# Altium project BlackChat.PrjPcb
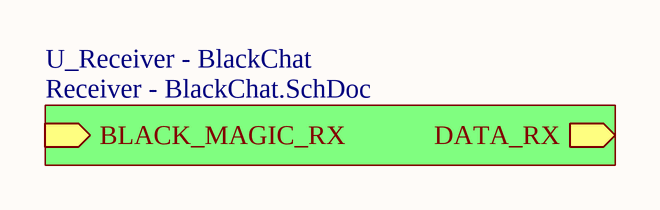
[diagram p0: Top Level - BlackChat.SchDoc]
4 sheets, 96 parts. Net scope: hierarchical (ports join the sheet entries above them; power ports are global).
Sheets:
  Top Level - BlackChat.SchDoc
    U_Receiver - BlackChat = Receiver - BlackChat.SchDoc
  Transmitter - BlackChat.SchDoc
  Digital - BlackChat.SchDoc

## Sheet Top Level - BlackChat.SchDoc
size Letter

### Sub-sheets
U_Receiver - BlackChat = Receiver - BlackChat.SchDoc: DATA_RX (out), BLACK_MAGIC_RX (in)

## Sheet Receiver - BlackChat.SchDoc
size Letter
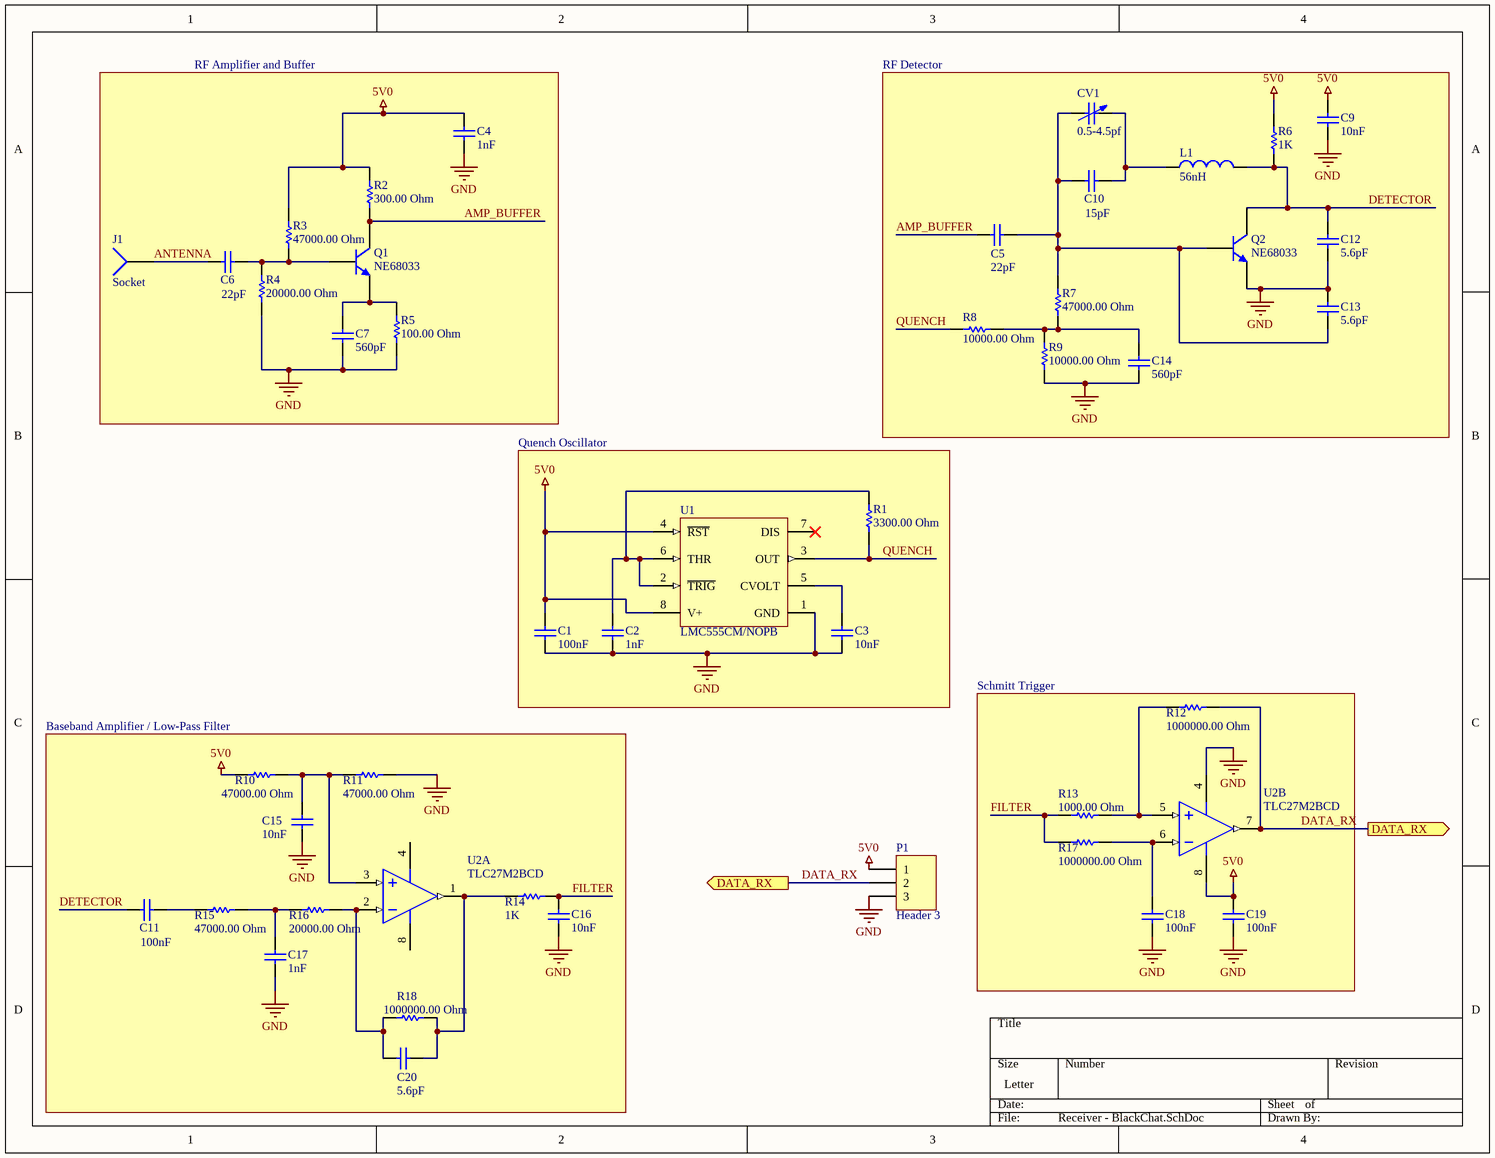
[diagram p1: Receiver - BlackChat.SchDoc]

### Parts
(Parts that share a designator on the sheet are numbered #1, #2 ... from top to bottom, then left to right.)
C1#1  value 100nF  [CAPC0805(2012)100_M]  (hidden comment: CAP 100nF 25V 0805(2012))
C2#1  value 1nF  [CAPC0805(2012)100_N]  (hidden comment: CAP 1nF 25V 0805(2012))
C3#1  value 10nF  [CAPC0805(2012)75_L]  (hidden comment: CAP 10nF 25V 0805(2012))
C4#1  value 1nF  [CAPC0805(2012)145_N]  (hidden comment: CAP 1nF 16V 0805(2012))
C5#1  value 22pF  [CAPC0805(2012)75_L]  (hidden comment: CAP 22pF 16V 0805(2012))
C6#1  value 22pF  [CAPC0805(2012)75_L]  (hidden comment: CAP 22pF 16V 0805(2012))
C7#1  value 560pF  [CAPC0805(2012)145_N]  (hidden comment: CAP 560pF 16V 0805(2012))
C9#1  value 10nF  [CAPC0805(2012)145_N]  (hidden comment: CAP 10nF 16V 0805(2012))
C10#1  value 15pF  [CAPC0805(2012)100_L]  (hidden comment: CAP 1.5pF 16V 0805(2012))
C11#1  value 100nF  [CAPC0805(2012)100_L]  (hidden comment: CAP 100nF 16V 0805(2012))
C12#1  value 5.6pF  [CAPC0805(2012)75_M]  (hidden comment: CAP 5.6pF 16V 0805(2012))
C13  value 5.6pF  [CAPC0805(2012)75_M]  (hidden comment: CAP 5.6pF 16V 0805(2012))
C14  value 560pF  [CAPC0805(2012)145_N]  (hidden comment: CAP 560pF 16V 0805(2012))
C15  value 10nF  [CAPC0805(2012)145_N]  (hidden comment: CAP 10nF 16V 0805(2012))
C16  value 10nF  [CAPC0805(2012)145_N]  (hidden comment: CAP 10nF 16V 0805(2012))
C17  value 1nF  [CAPC0805(2012)100_N]  (hidden comment: CAP 1nF 25V 0805(2012))
C18  value 100nF  [CAPC0805(2012)100_M]  (hidden comment: CAP 100nF 25V 0805(2012))
C19  value 100nF  [CAPC0805(2012)100_M]  (hidden comment: CAP 100nF 25V 0805(2012))
C20  value 5.6pF  [CAPC0805(2012)75_M]  (hidden comment: CAP 5.6pF 16V 0805(2012))
CV1  0.5-4.5pf  [CAP-GSX364]
J1#1  Socket  [PIN1]
L1  56nH  [C1210]
P1#1  Header 3  [HDR1X3]
Q1  NE68033  [SOT95P275X120-3N]
Q2  NE68033  [SOT95P275X120-3N]
R1#1  value 3300.00 Ohm  [RESC0805(2012)_M]  (hidden comment: 3K3 5% 0805(2012))
R2#1  value 300.00 Ohm  [RESC0805(2012)_M]  (hidden comment: 300R 1% 0805(2012))
R3#1  value 47000.00 Ohm  [RESC0805(2012)_L]  (hidden comment: 47K 5% 0805(2012))
R4  value 20000.00 Ohm  [RESC0805(2012)_L]  (hidden comment: 20K 5% 0805(2012))
R5  value 100.00 Ohm  [RESC0805(2012)_M]  (hidden comment: 100R 5% 0805(2012))
R6  value 1K  [RESC0805(2012)_N]  (hidden comment: 1K 5% 0805(2012))
R7  value 47000.00 Ohm  [RESC0805(2012)_L]  (hidden comment: 47K 5% 0805(2012))
R8  value 10000.00 Ohm  [RESC0805(2012)_L]  (hidden comment: 10K 5% 0805(2012))
R9  value 10000.00 Ohm  [RESC0805(2012)_L]  (hidden comment: 10K 5% 0805(2012))
R10  value 47000.00 Ohm  [RESC0805(2012)_N]  (hidden comment: 47K 1% 0805(2012))
R11  value 47000.00 Ohm  [RESC0805(2012)_N]  (hidden comment: 47K 1% 0805(2012))
R12  value 1000000.00 Ohm  [RESC0805(2012)_N]  (hidden comment: 1M 1% 0805(2012))
R13  value 1000.00 Ohm  [RESC0805(2012)_N]  (hidden comment: 1K 5% 0805(2012))
R14  value 1K  [RESC0805(2012)_N]  (hidden comment: 1K 5% 0805(2012))
R15  value 47000.00 Ohm  [RESC0805(2012)_N]  (hidden comment: 47K 1% 0805(2012))
R16  value 20000.00 Ohm  [RESC0805(2012)_N]  (hidden comment: 20K 1% 0805(2012))
R17  value 1000000.00 Ohm  [RESC0805(2012)_N]  (hidden comment: 1M 1% 0805(2012))
R18  value 1000000.00 Ohm  [RESC0805(2012)_N]  (hidden comment: 1M 1% 0805(2012))
U1#1  LMC555CM/NOPB  [M08A_M]
U2#1  TLC27M2BCD  [TI-D8_L]  (parts A,B of 2)

### Blocks framed on the sheet
RF Amplifier and Buffer: C4#1 C6#1 C7#1 J1#1 Q1 R2#1 R3#1 R4 R5
RF Detector: C5#1 C9#1 C10#1 C12#1 C13 C14 CV1 L1 Q2 R6-R9
Quench Oscillator: C1#1 C2#1 C3#1 R1#1 U1#1
Baseband Amplifier / Low-Pass Filter: C11#1 C15-C17 C20 R10 R11 R14-R16 R18 U2#1
Schmitt Trigger: C18 C19 R12 R13 R17 U2#1

### Ports
DATA_RX (out)

### Nets
5V0: C1#1.1 C4#1.2 C9#1.2 C19.1 P1#1.1 R2#1.2 R3#1.2 R6.2 R10.1 U1#1.4(~{RST}) U1#1.8(V+) U2#1.8(VCC)
GND: C1#1.2 C2#1.1 C3#1.1 C4#1.1 C7#1.2 C9#1.1 C12#1.1 C13.1 C14.1 C15.1 C16.1 C17.1 C18.2 C19.2 P1#1.3 Q2.1(E) R4.1 R5.1 R9.1 R11.2 U1#1.1(GND) U2#1.4(GND)
AMP_BUFFER: C5#1.1 Q1.3(C) R2#1.1
ANTENNA: C6#1.1 J1#1.1
DATA_RX: P1#1.2 R12.2 U2#1.7(OUT2) ; port DATA_RX
DETECTOR: C11#1.1 C12#1.2 L1.2 Q2.3(C) R6.1
FILTER: C16.2 R13.1 R14.2 R17.1
QUENCH: R1#1.1 R8.2 U1#1.3(OUT)
NetC2#1_2: C2#1.2 R1#1.2 U1#1.2(~{TRIG}) U1#1.6(THR)
NetC3#1_2: C3#1.2 U1#1.5(CVOLT)
NetC5#1_2: C5#1.2 C10#1.1 C13.2 CV1.1 Q2.2(B) R7.2
NetC6#1_2: C6#1.2 Q1.2(B) R3#1.1 R4.2
NetC7#1_1: C7#1.1 Q1.1(E) R5.2
NetC10#1_2: C10#1.2 CV1.2 L1.1
NetC11#1_2: C11#1.2 R15.1
NetC14_2: C14.2 R7.1 R8.1 R9.2
NetC15_2: C15.2 R10.2 R11.1 U2#1.3(IN1+)
NetC17_2: C17.2 R15.2 R16.1
NetC18_1: C18.1 R17.2 U2#1.6(IN2-)
NetC20_1: C20.1 R14.1 R18.2 U2#1.1(OUT1)
NetC20_2: C20.2 R16.2 R18.1 U2#1.2(IN1-)
NetR12_1: R12.1 R13.2 U2#1.5(IN2+)

Not connected (* = marked no-connect by the designer): U1#1 7(DIS)*

### Library data of the parts
C1#1 C18 C19 = CMP-1036-04409-1: CAP 100nF 25V ±5% 0805 (2012 Metric) Thickness 1mm SMD; Case-EIA: 0805; Case-Metric: 2012; Max Thickness: 1 mm; Technology: SMT; Rated Voltage: 25 V; Tolerance: ±5%
C2#1 C17 = CMP-1036-02963-1: CAP 1nF 25V ±1% 0805 (2012 Metric) Thickness 1mm SMD; Case-EIA: 0805; Case-Metric: 2012; Rated Voltage: 25 V; Max Thickness: 1 mm; Technology: SMT; Tolerance: ±1%
C3#1 = CMP-1036-03827-1: CAP 10nF 25V ±5% 0805 (2012 Metric) Thickness 0.75mm SMD; Case-EIA: 0805; Case-Metric: 2012; Technology: SMT; Tolerance: ±5%; Max Thickness: 0.75 mm; Rated Voltage: 25 V
C4#1 = CMP-1036-02959-1: CAP 1nF 16V ±10% 0805 (2012 Metric) Thickness 1.45mm SMD; Case-EIA: 0805; Case-Metric: 2012; Rated Voltage: 16 V; Tolerance: ±10%; Max Thickness: 1.45 mm; Technology: SMT
C5#1 = CMP-1036-00271-1: CAP 22pF 16V ±0.5pF 0805 (2012 Metric) Thickness 0.75mm SMD; Case-EIA: 0805; Case-Metric: 2012; Max Thickness: 0.75 mm; Technology: SMT; Rated Voltage: 16 V; Tolerance: ±0.5pF
C6#1 = CMP-1036-01219-1: CAP 22pF 16V ±5% 0805 (2012 Metric) Thickness 0.75mm SMD; Case-Metric: 2012; Case-EIA: 0805; Technology: SMT; Max Thickness: 0.75 mm; Tolerance: ±5%; Rated Voltage: 16 V
C7#1 C14 = CMP-1036-02734-1: CAP 560pF 16V ±10% 0805 (2012 Metric) Thickness 1.45mm SMD; Case-Metric: 2012; Case-EIA: 0805; Rated Voltage: 16 V; Technology: SMT; Tolerance: ±10%; Max Thickness: 1.45 mm
C9#1 C15 C16 = CMP-1036-03817-1: CAP 10nF 16V ±5% 0805 (2012 Metric) Thickness 1.45mm SMD; Case-EIA: 0805; Case-Metric: 2012; Technology: SMT; Rated Voltage: 16 V; Max Thickness: 1.45 mm; Tolerance: ±5%
C10#1 = CMP-1036-00160-1: CAP 1.5pF 16V ±0.1pF 0805 (2012 Metric) Thickness 1mm SMD; Case-Metric: 2012; Case-EIA: 0805; Rated Voltage: 16 V; Technology: SMT; Tolerance: ±0.1pF; Max Thickness: 1 mm
C11#1 = CMP-1036-04400-1: CAP 100nF 16V ±5% 0805 (2012 Metric) Thickness 1mm SMD; Case-EIA: 0805; Case-Metric: 2012; Max Thickness: 1 mm; Tolerance: ±5%; Technology: SMT; Rated Voltage: 16 V
C12#1 C13 C20 = CMP-1036-00602-1: CAP 5.6pF 16V ±0.25pF 0805 (2012 Metric) Thickness 0.75mm SMD; Case-Metric: 2012; Case-EIA: 0805; Technology: SMT; Max Thickness: 0.75 mm; Tolerance: ±0.25pF; Rated Voltage: 16 V
CV1 = GSX364: 0.5pF to 4.5pF variable capacitor.; Value: 0.5-4.5pf
L1 = Inductor: Generic Inductor; Value: 56nH
P1#1 = Header 3: Header, 3-Pin; LatestRevisionDate: 17-Jul-2002; LatestRevisionNote: Re-released for DXP Platform.; Publisher: Altium Limited
Q1 Q2 = NE68033: NPN SILICON HIGH FREQUENCY TRANSISTOR
R1#1 = CMP-1013-00086-1: 3K3 0.125W 5% 0805 (2012 Metric)  SMD; Case-Metric: 2012; Case-EIA: 0805; Tolerance: 5 %; Technology: SMT; Power: 0.125 W
R2#1 = CMP-1013-00449-1: 300R 0.125W 1% 0805 (2012 Metric)  SMD; Case-Metric: 2012; Case-EIA: 0805; Technology: SMT; Tolerance: 1 %; Power: 0.125 W
R3#1 R7 = CMP-1013-00114-1: 47K 0.125W 5% 0805 (2012 Metric)  SMD; Case-Metric: 2012; Case-EIA: 0805; Tolerance: 5 %; Power: 0.125 W; Technology: SMT
R4 = CMP-1013-00105-1: 20K 0.125W 5% 0805 (2012 Metric)  SMD; Case-Metric: 2012; Case-EIA: 0805; Technology: SMT; Power: 0.125 W; Tolerance: 5 %
R5 = CMP-1013-00050-1: 100R 0.125W 5% 0805 (2012 Metric)  SMD; Case-EIA: 0805; Case-Metric: 2012; Tolerance: 5 %; Power: 0.125 W; Technology: SMT
R6 R13 R14 = CMP-1013-00074-1: 1K 0.125W 5% 0805 (2012 Metric)  SMD; Case-EIA: 0805; Case-Metric: 2012; Technology: SMT; Power: 0.125 W; Tolerance: 5 %
R8 R9 = CMP-1013-00098-1: 10K 0.125W 5% 0805 (2012 Metric)  SMD; Case-EIA: 0805; Case-Metric: 2012; Power: 0.125 W; Technology: SMT; Tolerance: 5 %
R10 R11 R15 = CMP-1013-00699-1: 47K 0.125W 1% 0805 (2012 Metric)  SMD; Case-Metric: 2012; Case-EIA: 0805; Power: 0.125 W; Tolerance: 1 %; Technology: SMT
R12 R17 R18 = CMP-1013-00849-1: 1M 0.125W 1% 0805 (2012 Metric)  SMD; Case-Metric: 2012; Case-EIA: 0805; Technology: SMT; Power: 0.125 W; Tolerance: 1 %
R16 = CMP-1013-00655-1: 20K 0.125W 1% 0805 (2012 Metric)  SMD; Case-EIA: 0805; Case-Metric: 2012; Power: 0.125 W; Tolerance: 1 %; Technology: SMT
U1#1 = CMP-0056-00124-2: CMOS Timer, 8-pin Narrow SOIC, Pb-Free; Manufacturer: National Semiconductor; PackageTopMarking: NSZXTT*LMC*555CM; PowerWise: N; CompType: Analog IC; DatasheetVersion: May-2006; ComponentLink2URL: http://www.national.com/pf/LM/LMC555.html; ComponentLink3URL: http://www.national.com/packaging/folders/m08a.html; PackageVersion: revM, May-2009; PackageDescription: SOIC Narrow, 4.9 x 3.9 x 1.45mm, 8 Lead, 1.27mm Pitch; Code_JEDEC: MS-012-AA; ComponentLink1URL: http://www.national.com/ds/LM/LMC555.pdf; RoHS: Y; PinCount: 8; Code_IPC: SOIC127P600-8; ComponentLink3Description: M08A Package Page; ComponentLink1Description: LMC555 Datasheet; PackageReference: M08A; ComponentLink2Description: LMC555 Web Page; RevisionNote: Component URLs added
U2#1 = CMP-0017-00353-1: LinCMOS(TM) Precision Dual Operational Amplifier, 3 to 16 V, 0 to 70 degC, 8-pin SOIC (D8), Green (RoHS & no Sb/Br); Manufacturer: Texas Instruments; Total Supply Voltage(Max)(+5V is 5, +/-5V is 10): 16; Rating: Catalog; Number of Channels: 2; IIB(Max)(pA): 600; Vn at 1kHz(Typ)(nV/rtHz): 32; Offset Drift(Typ)(uV/C): 1.7; CMRR(Min)(dB): 65; Iq per channel(Max)(mA): 0.28; Total Supply Voltage(Min)(+5V is 5, +/-5V is 10): 3; GBW(Typ)(MHz): 0.525; Slew Rate(Typ)(V/us): 0.43; Sub Family: General Purpose Amplifier, Low Power Amp (<=500uA); ComponentLink1Description: Manufacturer URL; Mounting Technology: Surface Mount; ComponentLink1URL: http://www.ti.com/; PartNumber: TLC27M2BCD; ComponentLink3Description: Package Specification; ComponentLink3URL: http://www.ti.com/litv/pdf/msoi002j; PackageVersion: 4040047-3/M, 06/2011; ComponentLink2URL: http://www.ti.com/lit/ds/symlink/tlc27m2b.pdf; Eco-Plan: Green (RoHS & no Sb/Br); PackageDescription: 8-Pin Plastic Small Outline, Body 4.9 x 3.9 mm, Pitch 1.27 mm; Vio (25C)(Max)(mV): 2; Code_JEDEC: MS-012; ComponentLink2Description: Datasheet; PackageReference: D8; DatasheetVersion: SLOS051E
J1#1 = Socket: LatestRevisionDate: 17-Jul-2002; LatestRevisionNote: Re-released for DXP Platform.; Publisher: Altium Limited

## Sheet Transmitter - BlackChat.SchDoc
size Letter
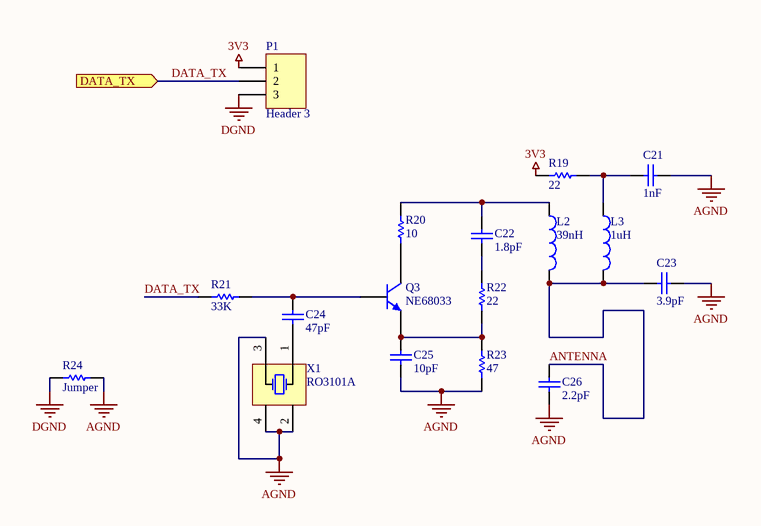
[diagram p2: Transmitter - BlackChat.SchDoc]

### Parts
(Parts that share a designator on the sheet are numbered #1, #2 ... from top to bottom, then left to right.)
C21  value 1nF  [CAPC0805(2012)100_L]  (hidden comment: CAP 1nF 16V 0805(2012))
C22  value 1.8pF  [CAPC0805(2012)75_L]  (hidden comment: CAP 1.8pF 16V 0805(2012))
C23  value 3.9pF  [CAPC0805(2012)75_N]  (hidden comment: CAP 3.9pF 16V 0805(2012))
C24  value 47pF  [CAPC0805(2012)100_L]  (hidden comment: CAP 47pF 16V 0805(2012))
C25  value 10pF  [CAPC0805(2012)100_L]  (hidden comment: CAP 10pF 16V 0805(2012))
C26  value 2.2pF  [CAPC0805(2012)75_M]  (hidden comment: CAP 2.2pF 16V 0805(2012))
L2  39nH  [C1210]
L3  1uH  [C1210]
P1#2  Header 3  [HDR1X3]
Q3  NE68033  [SOT95P275X120-3N]
R19  value 22  [RESC0805(2012)_M]  (hidden comment: 22R 5% 0805(2012))
R20  value 10  [RESC0805(2012)_L]  (hidden comment: 10R 5% 0805(2012))
R21  value 33K  [RESC0805(2012)_L]  (hidden comment: 33K 1% 0805(2012))
R22  value 22  [RESC0805(2012)_M]  (hidden comment: 22R 5% 0805(2012))
R23  value 47  [RESC0805(2012)_M]  (hidden comment: 47R 5% 0805(2012))
R24  value Jumper  [RESC0805(2012)_N]  (hidden comment: Jumper 0805(2012))
X1  RO3101A  [RO3101A]

### Ports
DATA_TX (in)

### Nets
3V3: P1#2.1 R19.2
AGND: C21.1 C23.1 C25.1 C26.2 R23.1 R24.2 X1.2(CASE) X1.3(Terminal_2) X1.4(CASE)
DGND: P1#2.3 R24.1
ANTENNA: C23.2 C26.1 L2.2 L3.2
DATA_TX: P1#2.2 R21.2 ; port DATA_TX
NetC21_2: C21.2 L3.1 R19.1
NetC22_1: C22.1 R22.2
NetC22_2: C22.2 L2.1 R20.2
NetC24_1: C24.1 X1.1(Terminal_1)
NetC24_2: C24.2 Q3.2(B) R21.1
NetC25_2: C25.2 Q3.1(E) R22.1 R23.2
NetQ3_3: Q3.3(C) R20.1

### Library data of the parts
C21 = CMP-1036-02955-1: CAP 1nF 16V ±1% 0805 (2012 Metric) Thickness 1mm SMD; Case-EIA: 0805; Case-Metric: 2012; Technology: SMT; Tolerance: ±1%; Max Thickness: 1 mm; Rated Voltage: 16 V
C22 = CMP-1036-00213-1: CAP 1.8pF 16V ±0.1pF 0805 (2012 Metric) Thickness 0.75mm SMD; Case-Metric: 2012; Case-EIA: 0805; Rated Voltage: 16 V; Tolerance: ±0.1pF; Max Thickness: 0.75 mm; Technology: SMT
C23 = CMP-1036-00461-1: CAP 3.9pF 16V ±0.1pF 0805 (2012 Metric) Thickness 0.75mm SMD; Case-Metric: 2012; Case-EIA: 0805; Rated Voltage: 16 V; Tolerance: ±0.1pF; Technology: SMT; Max Thickness: 0.75 mm
C24 = CMP-1036-01589-1: CAP 47pF 16V ±0.5pF 0805 (2012 Metric) Thickness 1mm SMD; Case-Metric: 2012; Case-EIA: 0805; Technology: SMT; Rated Voltage: 16 V; Tolerance: ±0.5pF; Max Thickness: 1 mm
C25 = CMP-1036-00830-1: CAP 10pF 16V ±0.25pF 0805 (2012 Metric) Thickness 1mm SMD; Case-EIA: 0805; Case-Metric: 2012; Max Thickness: 1 mm; Tolerance: ±0.25pF; Rated Voltage: 16 V; Technology: SMT
C26 = CMP-1036-00267-1: CAP 2.2pF 16V ±0.1pF 0805 (2012 Metric) Thickness 0.75mm SMD; Case-Metric: 2012; Case-EIA: 0805; Technology: SMT; Rated Voltage: 16 V; Tolerance: ±0.1pF; Max Thickness: 0.75 mm
L2 L3 = Inductor: Generic Inductor
  L2: Value: 39nH
  L3: Value: 1uH
P1#2 = Header 3: Header, 3-Pin; LatestRevisionDate: 17-Jul-2002; LatestRevisionNote: Re-released for DXP Platform.; Publisher: Altium Limited
Q3 = NE68033: NPN SILICON HIGH FREQUENCY TRANSISTOR
R19 R22 = CMP-1013-00034-1: 22R 0.125W 5% 0805 (2012 Metric)  SMD; Case-Metric: 2012; Case-EIA: 0805; Power: 0.125 W; Technology: SMT; Tolerance: 5 %
R20 = CMP-1013-00026-1: 10R 0.125W 5% 0805 (2012 Metric)  SMD; Case-EIA: 0805; Case-Metric: 2012; Technology: SMT; Power: 0.125 W; Tolerance: 5 %
R21 = CMP-1013-00680-1: 33K 0.125W 1% 0805 (2012 Metric)  SMD; Case-EIA: 0805; Case-Metric: 2012; Technology: SMT; Tolerance: 1 %; Power: 0.125 W
R23 = CMP-1013-00042-1: 47R 0.125W 5% 0805 (2012 Metric)  SMD; Case-Metric: 2012; Case-EIA: 0805; Tolerance: 5 %; Power: 0.125 W; Technology: SMT
R24 = CMP-1013-00001-1: Jumper 0805 (2012 Metric); Case-EIA: 0805; Tolerance: None; Case-Metric: 2012; Technology: SMT; Power: None
X1 = RO3101A: 433.92 MHz  SAW  Resonator; ComponentLink1Description: Datasheet; ComponentLink1URL: http://www.mouser.com/catalog/specsheets/ro3101a1.pdf

## Sheet Digital - BlackChat.SchDoc
size B
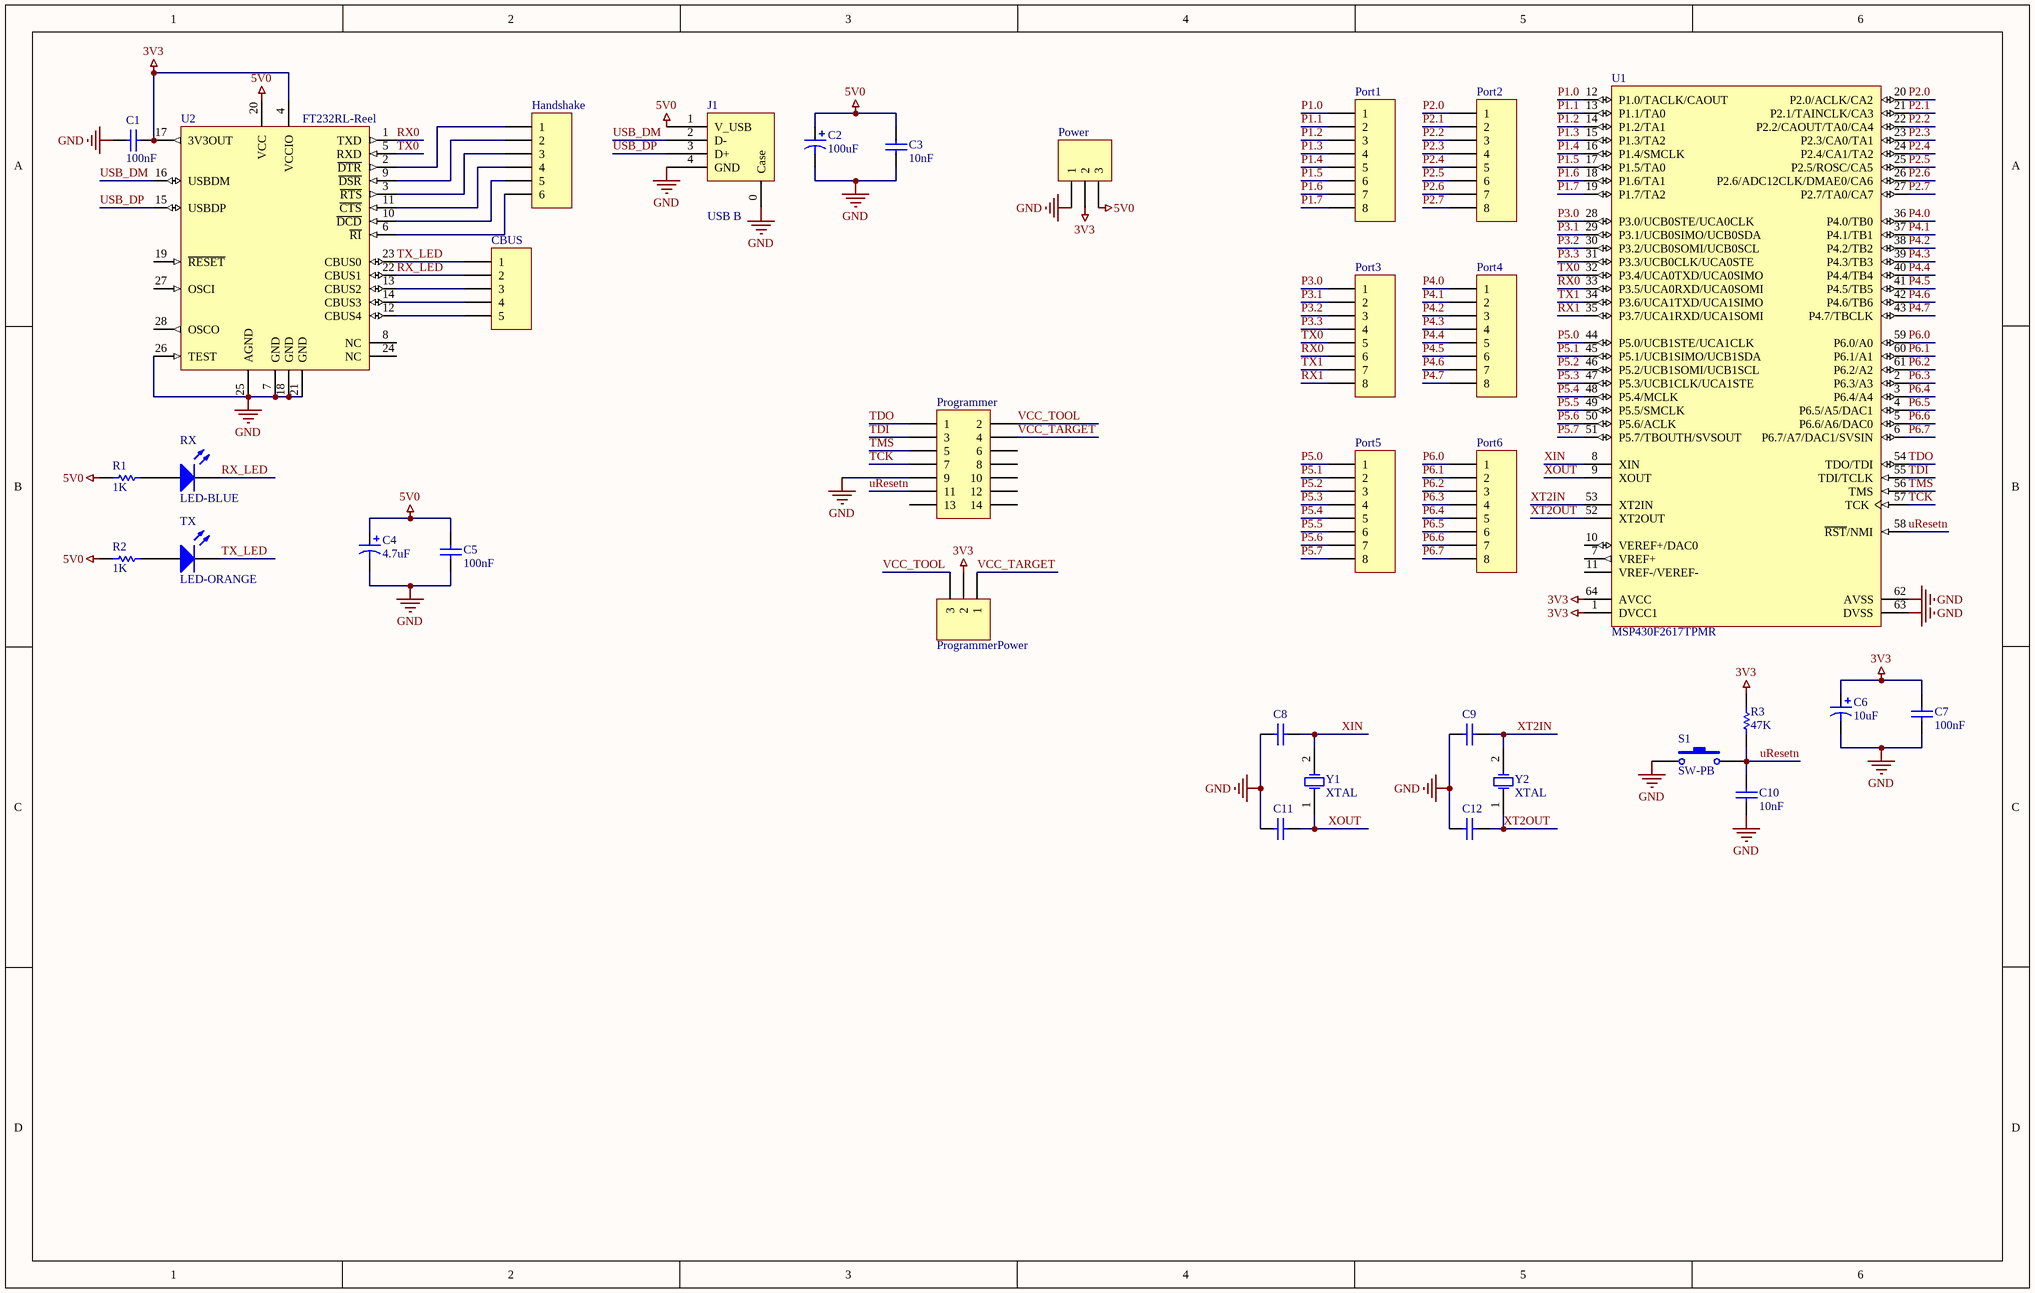
[diagram p3: Digital - BlackChat.SchDoc]

### Parts
(Parts that share a designator on the sheet are numbered #1, #2 ... from top to bottom, then left to right.)
C1#2  value 100nF  [CAP-0805]  (hidden comment: Cap)
C2#2  value 100uF  [CAP-0805]  (hidden comment: Cap Pol3)
C3#2  value 10nF  [CAP-0805]  (hidden comment: Cap)
C4#2  value 4.7uF  [CAP-0805]  (hidden comment: Cap Pol3)
C5#2  value 100nF  [CAP-0805]  (hidden comment: Cap)
C6#2  value 10uF  [CAP-0805]  (hidden comment: Cap Pol3)
C7#2  value 100nF  [CAP-0805]  (hidden comment: Cap)
C8  Cap  [CAP-0805]  (value not drawn)
C9#2  Cap  [CAP-0805]  (value not drawn)
C10#2  value 10nF  [CAP-0805]  (hidden comment: Cap)
C11#2  Cap  [CAP-0805]  (value not drawn)
C12#2  Cap  [CAP-0805]  (value not drawn)
CBUS  Header 5  [HDR1X5]  (value not drawn)
Handshake  Header 6  [HDR1X6]  (value not drawn)
J1#2  USB B  [USB-B]
Port1  (no value)  [HDR1X8]
Port2  (no value)  [HDR1X8]
Port3  Header 8  [HDR1X8]  (value not drawn)
Port4  Header 8  [HDR1X8]  (value not drawn)
Port5  Header 8  [HDR1X8]  (value not drawn)
Port6  Header 8  [HDR1X8]  (value not drawn)
Power  Header 3  [HDR1X3]  (value not drawn)
Programmer  Header 7X2  [HDR2X7]  (value not drawn)
ProgrammerPower  Header 3  [HDR1X3]  (value not drawn)
R1#2  value 1K  [RES-0805]  (hidden comment: Res1)
R2#2  value 1K  [RES-0805]  (hidden comment: Res1)
R3#2  value 47K  [RES-0805]  (hidden comment: Res1)
RX  LED-BLUE  [LED-0805]
S1  SW-PB  [SW PB]
TX  LED-ORANGE  [LED-0805]
U1#2  MSP430F2617TPMR  [TI-PM64_N]
U2#2  FT232RL-Reel  [SSOP-28_N]
Y1  XTAL  [R38]
Y2  XTAL  [R38]

### Nets
3V3: C1#2.1 C6#2.1 C7#2.2 Power.2 ProgrammerPower.2 R3#2.2 U1#2.1(DVCC1) U1#2.64(AVCC) U2#2.4(VCCIO) U2#2.17(3V3OUT)
5V0: C2#2.1 C3#2.2 C4#2.1 C5#2.2 J1#2.1(V_USB) Power.3 R1#2.2 R2#2.2 U2#2.20(VCC)
GND: C1#2.2 C2#2.2 C3#2.1 C4#2.2 C5#2.1 C6#2.2 C7#2.1 C8.2 C9#2.2 C10#2.1 C11#2.2 C12#2.2 J1#2.0(Case) J1#2.4(GND) Power.1 Programmer.9 S1.1 U1#2.62(AVSS) U1#2.63(DVSS) U2#2.7(GND) U2#2.18(GND) U2#2.21(GND) U2#2.25(AGND) U2#2.26(TEST)
P1.0: Port1.1 U1#2.12(P1.0/TACLK/CAOUT)
P1.1: Port1.2 U1#2.13(P1.1/TA0)
P1.2: Port1.3 U1#2.14(P1.2/TA1)
P1.3: Port1.4 U1#2.15(P1.3/TA2)
P1.4: Port1.5 U1#2.16(P1.4/SMCLK)
P1.5: Port1.6 U1#2.17(P1.5/TA0)
P1.6: Port1.7 U1#2.18(P1.6/TA1)
P1.7: Port1.8 U1#2.19(P1.7/TA2)
P2.0: Port2.1 U1#2.20(P2.0/ACLK/CA2)
P2.1: Port2.2 U1#2.21(P2.1/TAINCLK/CA3)
P2.2: Port2.3 U1#2.22(P2.2/CAOUT/TA0/CA4)
P2.3: Port2.4 U1#2.23(P2.3/CA0/TA1)
P2.4: Port2.5 U1#2.24(P2.4/CA1/TA2)
P2.5: Port2.6 U1#2.25(P2.5/ROSC/CA5)
P2.6: Port2.7 U1#2.26(P2.6/ADC12CLK/DMAE0/CA6)
P2.7: Port2.8 U1#2.27(P2.7/TA0/CA7)
P3.0: Port3.1 U1#2.28(P3.0/UCB0STE/UCA0CLK)
P3.1: Port3.2 U1#2.29(P3.1/UCB0SIMO/UCB0SDA)
P3.2: Port3.3 U1#2.30(P3.2/UCB0SOMI/UCB0SCL)
P3.3: Port3.4 U1#2.31(P3.3/UCB0CLK/UCA0STE)
P4.0: Port4.1 U1#2.36(P4.0/TB0)
P4.1: Port4.2 U1#2.37(P4.1/TB1)
P4.2: Port4.3 U1#2.38(P4.2/TB2)
P4.3: Port4.4 U1#2.39(P4.3/TB3)
P4.4: Port4.5 U1#2.40(P4.4/TB4)
P4.5: Port4.6 U1#2.41(P4.5/TB5)
P4.6: Port4.7 U1#2.42(P4.6/TB6)
P4.7: Port4.8 U1#2.43(P4.7/TBCLK)
P5.0: Port5.1 U1#2.44(P5.0/UCB1STE/UCA1CLK)
P5.1: Port5.2 U1#2.45(P5.1/UCB1SIMO/UCB1SDA)
P5.2: Port5.3 U1#2.46(P5.2/UCB1SOMI/UCB1SCL)
P5.3: Port5.4 U1#2.47(P5.3/UCB1CLK/UCA1STE)
P5.4: Port5.5 U1#2.48(P5.4/MCLK)
P5.5: Port5.6 U1#2.49(P5.5/SMCLK)
P5.6: Port5.7 U1#2.50(P5.6/ACLK)
P5.7: Port5.8 U1#2.51(P5.7/TBOUTH/SVSOUT)
P6.0: Port6.1 U1#2.59(P6.0/A0)
P6.1: Port6.2 U1#2.60(P6.1/A1)
P6.2: Port6.3 U1#2.61(P6.2/A2)
P6.3: Port6.4 U1#2.2(P6.3/A3)
P6.4: Port6.5 U1#2.3(P6.4/A4)
P6.5: Port6.6 U1#2.4(P6.5/A5/DAC1)
P6.6: Port6.7 U1#2.5(P6.6/A6/DAC0)
P6.7: Port6.8 U1#2.6(P6.7/A7/DAC1/SVSIN)
RX0: Port3.6 U1#2.33(P3.5/UCA0RXD/UCA0SOMI) U2#2.1(TXD)
RX1: Port3.8 U1#2.35(P3.7/UCA1RXD/UCA1SOMI)
RX_LED: CBUS.2 RX.2(K) U2#2.22(CBUS1)
TCK: Programmer.7 U1#2.57(TCK)
TDI: Programmer.3 U1#2.55(TDI/TCLK)
TDO: Programmer.1 U1#2.54(TDO/TDI)
TMS: Programmer.5 U1#2.56(TMS)
TX0: Port3.5 U1#2.32(P3.4/UCA0TXD/UCA0SIMO) U2#2.5(RXD)
TX1: Port3.7 U1#2.34(P3.6/UCA1TXD/UCA1SIMO)
TX_LED: CBUS.1 TX.2(K) U2#2.23(CBUS0)
uResetn: C10#2.2 Programmer.11 R3#2.1 S1.2 U1#2.58(~{RST}/NMI)
USB_DM: J1#2.2(D-) U2#2.16(USBDM)
USB_DP: J1#2.3(D+) U2#2.15(USBDP)
VCC_TARGET: Programmer.4 ProgrammerPower.1
VCC_TOOL: Programmer.2 ProgrammerPower.3
XIN: C8.1 U1#2.8(XIN) Y1.2(OSC2)
XOUT: C11#2.1 U1#2.9(XOUT) Y1.1(OSC1)
XT2IN: C9#2.1 U1#2.53(XT2IN) Y2.2(OSC2)
XT2OUT: C12#2.1 U1#2.52(XT2OUT) Y2.1(OSC1)
NetCBUS_3: CBUS.3 U2#2.13(CBUS2)
NetCBUS_4: CBUS.4 U2#2.14(CBUS3)
NetCBUS_5: CBUS.5 U2#2.12(CBUS4)
NetHandshake_1: Handshake.1 U2#2.2(~{DTR})
NetHandshake_2: Handshake.2 U2#2.9(~{DSR})
NetHandshake_3: Handshake.3 U2#2.3(~{RTS})
NetHandshake_4: Handshake.4 U2#2.11(~{CTS})
NetHandshake_5: Handshake.5 U2#2.10(~{DCD})
NetHandshake_6: Handshake.6 U2#2.6(~{RI})
NetR1#2_1: R1#2.1 RX.1(A)
NetR2#2_1: R2#2.1 TX.1(A)

Not connected (* = marked no-connect by the designer): Programmer 6 8 10 12 13 14; U1#2 7(VREF+) 10(VEREF+/DAC0) 11(VREF-/VEREF-); U2#2 8(NC) 19(~{RESET}) 24(NC) 27(OSCI) 28(OSCO)

### Library data of the parts
C1#2 C3#2 C5#2 C7#2 C10#2 = Cap: Capacitor; Published: 8-Jun-2000; LatestRevisionDate: 17-Jul-2002; LatestRevisionNote: Re-released for DXP Platform.; PackageReference: RAD-0.3; Publisher: Altium Limited; PackageDescription: Radial Cap, Thru-Hole; 2 Leads; 0.3 in Pin Spacing
C2#2 C4#2 C6#2 = Cap Pol3: Polarized Capacitor (Surface Mount); Published: 8-Jun-2000; LatestRevisionDate: 29-May-2009; LatestRevisionNote: IPC-7351 Footprint Added.; PackageReference: C0805; Publisher: Altium Limited; PackageDescription: Chip Capacitor
C8 C9#2 C11#2 C12#2 = Cap: Capacitor; Value: 100pF; Published: 8-Jun-2000; LatestRevisionDate: 17-Jul-2002; LatestRevisionNote: Re-released for DXP Platform.; PackageReference: RAD-0.3; Publisher: Altium Limited; PackageDescription: Radial Cap, Thru-Hole; 2 Leads; 0.3 in Pin Spacing
CBUS = Header 5: Header, 5-Pin; LatestRevisionDate: 17-Jul-2002; LatestRevisionNote: Re-released for DXP Platform.; Publisher: Altium Limited
Handshake = Header 6: Header, 6-Pin; LatestRevisionDate: 17-Jul-2002; LatestRevisionNote: Re-released for DXP Platform.; Publisher: Altium Limited
J1#2 = USB B: On Shore Technology USB-B1HSB6; Supplier 1: Digi-Key; Supplier Part Number 1: ED2983-ND
Port1-Port6 = Header 8: Header, 8-Pin; LatestRevisionDate: 17-Jul-2002; LatestRevisionNote: Re-released for DXP Platform.; Publisher: Altium Limited
Power ProgrammerPower = Header 3: Header, 3-Pin; LatestRevisionDate: 17-Jul-2002; LatestRevisionNote: Re-released for DXP Platform.; Publisher: Altium Limited
Programmer = Header 7X2: Header, 7-Pin, Dual row; LatestRevisionDate: 17-Jul-2002; LatestRevisionNote: Re-released for DXP Platform.; Publisher: Altium Limited
R1#2 R2#2 R3#2 = Res1: Resistor; Published: 8-Jun-2000; LatestRevisionDate: 17-Jul-2002; LatestRevisionNote: Re-released for DXP Platform.; PackageReference: AXIAL-0.3; Publisher: Altium Limited; PackageDescription: Axial Device, Thru-Hole; 2 Leads; 0.3 in Pin Spacing
RX TX = LED-GENERIC: Light Emitting Diode
S1 = SW-PB: DIGIKEY SW400-ND; Published: 24-Mar-1999; LatestRevisionDate: 17-Jul-2002; LatestRevisionNote: Re-released for DXP Platform.; Publisher: Altium Limited
U1#2 = MSP430F2617TPMR: 16 MHz Mixed Signal Microcontroller with 92 KB Flash, 8192 B SRAM and 48 GPIOs, -40 to 105 degC, 64-pin QFP (PM), Green (RoHS & no Sb/Br); Manufacturer: Texas Instruments; ADC: 12-bit SAR; ADC Channels: 8; Brown Out Reset: Yes; DMA: 3; Flash(KB): 92; Frequency(MHz): 16; GPIO: 48; Multiplier: 16x16; SRAM(B): 8192; SubFamily: 2 Series, Extended Temp; Timers - 16-bit: 2; DatasheetVersion: SLAS541K; PackageVersion: 4040152/C; PackageReference: PM64; PackageDescription: 64-Pin Plastic Quad Flat Pack, Body 10 x 10 mm, Pitch 0.5 mm; Supplier 1: Digi-Key; Supplier Part Number 1: 296-26222-ND; Supplier 2: Farnell; Supplier Part Number 2: 1649453; Supplier 3: Newark; Supplier Part Number 3: 61M7904; Supplier 4: Mouser; Supplier Part Number 4: 595-MSP430F2617TPM; Comparators: Yes; Eco-Plan: Green (RoHS & no Sb/Br); SVS: Yes; Temp Sensor: Yes; USCI_A (UART/LIN/IrDA/SPI): 2; USCI_B (I2C & SPI): 2; Watchdog: Yes; Mounting Technology: Surface Mount; Code_JEDEC: MS-026; PartNumber: MSP430F2617TPMR; ComponentLink1Description: Manufacturer URL; ComponentLink1URL: http://www.ti.com/; ComponentLink2Description: Datasheet; ComponentLink2URL: http://www.ti.com/general/docs/lit/getliterature.tsp?genericPartNumber=MSP430F2617&fileType=pdf; ComponentLink3Description: Package Specification; ComponentLink3URL: http://www.ti.com/lit/ml/mtqf008a/mtqf008a.pdf
U2#2 = FT232RL-Reel: USB UART Asynchronous Serial Data Transfer Chip, SSOP-28, Tape and Reel; Published: 19-Aug-2010; DatasheetVersion: ver 2.07, Jul-2010; PackageVersion: 2010; PackageReference: SSOP-28; Publisher: Altium Limited; PackageDescription: 28-Pin Small Outline Package 0.65 mm Pitch; ComponentLink1Description: Manufacturer Link; ComponentLink1URL: http://www.ftdichip.com/Products/ICs/FT232R.htm; ComponentLink2Description: Datasheet; ComponentLink2URL: http://www.ftdichip.com/Support/Documents/DataSheets/ICs/DS_FT232R.pdf
Y1 Y2 = XTAL: Crystal Oscillator; Published: 8-Jun-2000; LatestRevisionDate: 17-Jul-2002; LatestRevisionNote: Re-released for DXP Platform.; PackageReference: R38; Publisher: Altium Limited; PackageDescription: Crystal, Thru-Hole; 2 Leads; Body 3.1 x 8.2 mm (Dia.xH)

## Nets that join several sheets
3V3: Transmitter - BlackChat (P1#2.1 R19.2), Digital - BlackChat (10 pins)
5V0: Receiver - BlackChat (12 pins), Digital - BlackChat (9 pins)
GND: Receiver - BlackChat (22 pins), Digital - BlackChat (24 pins)